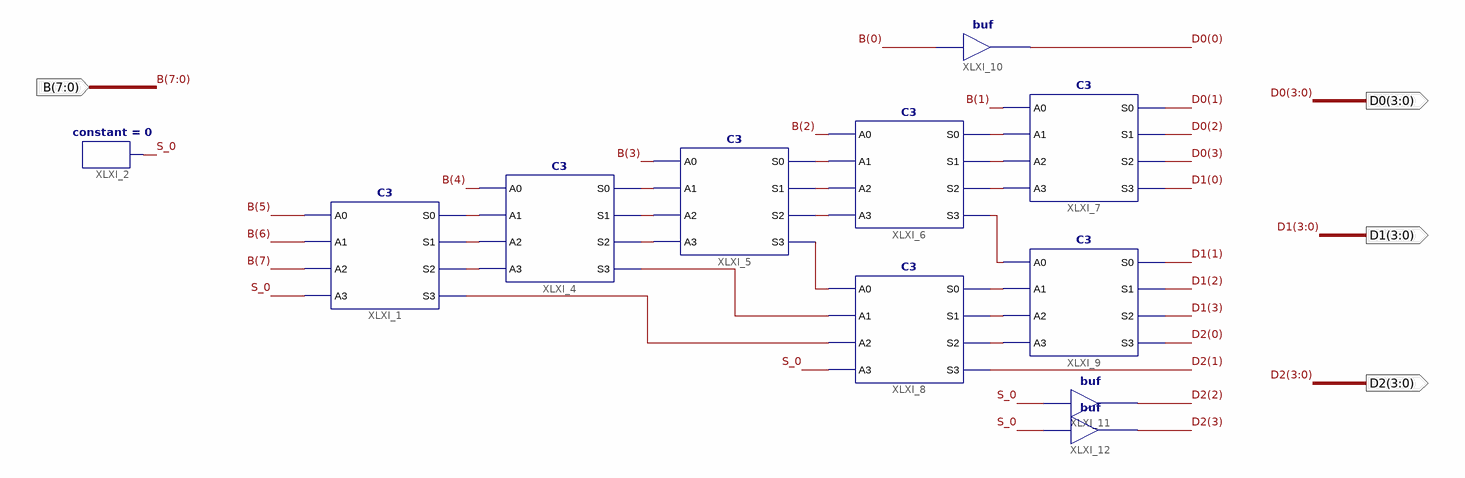
[diagram p0: schematic sheet 1]
// Xilinx ISE schematic bin2bcd_8.sch (spartan3e) as structural Verilog: 11 symbols, 4 ports
module bin2bcd_8 (
  input  [7:0] B,
  output [3:0] D0,
  output [3:0] D1,
  output [3:0] D2
);

  wire S_0, XLXN_22, XLXN_23, XLXN_24, XLXN_25, XLXN_26, XLXN_27, XLXN_28, XLXN_29, XLXN_30, XLXN_31,
       XLXN_32, XLXN_33, XLXN_36, XLXN_37, XLXN_38, XLXN_39, XLXN_41, XLXN_42, XLXN_43;

  C3 XLXI_1 (.A0(B[5]), .A1(B[6]), .A2(B[7]), .A3(S_0), .S3(XLXN_36), .S0(XLXN_22), .S1(XLXN_23), .S2(XLXN_24));
  constant #(.CValue("0")) XLXI_2 (.O(S_0));
  C3 XLXI_4 (
    .A0(B[4]), .A1(XLXN_22), .A2(XLXN_23), .A3(XLXN_24), .S3(XLXN_37), .S0(XLXN_27), .S1(XLXN_26),
    .S2(XLXN_25));
  C3 XLXI_5 (
    .A0(B[3]), .A1(XLXN_27), .A2(XLXN_26), .A3(XLXN_25), .S3(XLXN_38), .S0(XLXN_28), .S1(XLXN_29),
    .S2(XLXN_30));
  C3 XLXI_6 (
    .A0(B[2]), .A1(XLXN_28), .A2(XLXN_29), .A3(XLXN_30), .S3(XLXN_39), .S0(XLXN_31), .S1(XLXN_32),
    .S2(XLXN_33));
  C3 XLXI_7 (.A0(B[1]), .A1(XLXN_31), .A2(XLXN_32), .A3(XLXN_33), .S3(D1[0]), .S0(D0[1]), .S1(D0[2]), .S2(D0[3]));
  C3 XLXI_8 (.A0(XLXN_38), .A1(XLXN_37), .A2(XLXN_36), .A3(S_0), .S3(D2[1]), .S0(XLXN_41), .S1(XLXN_42), .S2(XLXN_43));
  C3 XLXI_9 (.A0(XLXN_39), .A1(XLXN_41), .A2(XLXN_42), .A3(XLXN_43), .S3(D2[0]), .S0(D1[1]), .S1(D1[2]), .S2(D1[3]));
  buf XLXI_10 (D0[0], B[0]);
  buf XLXI_11 (D2[2], S_0);
  buf XLXI_12 (D2[3], S_0);
endmodule
